# Altium schematic sheet Ultrascale_EG.SchDoc
size B; Organization: Altium Limited; Address1: L3, 12a Rodborough Rd; Address2: Frenchs Forest; Address3: NSW; Address4: Australia 2086
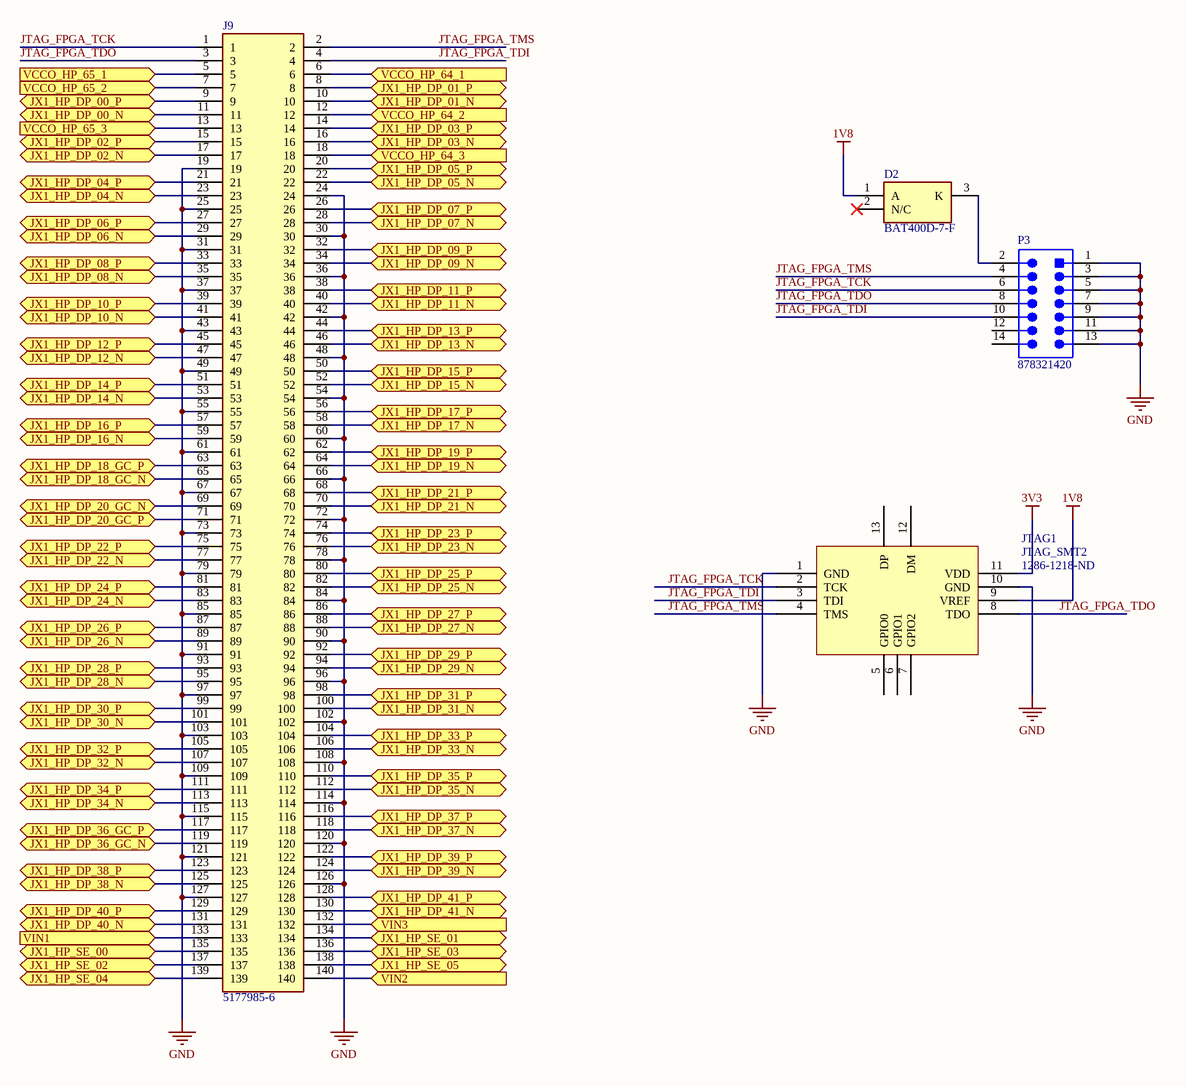
[diagram p0: Ultrascale_EG.SchDoc]

## Parts
D2  BAT400D-7-F  [SOT96P240X110-3N]
J9  5177985-6  [5177985-6]
JTAG1  JTAG_SMT2  Supplier Part Number 1: 1286-1218-ND  [JTAG_SMT2]
P3  878321420  [MOLX-878321420_V]

## Ports
JX1_HP_DP_00_N (bidir), JX1_HP_DP_00_P (bidir), JX1_HP_DP_01_N (bidir), JX1_HP_DP_01_P (bidir), JX1_HP_DP_02_N (bidir), JX1_HP_DP_02_P (bidir), JX1_HP_DP_03_N (bidir), JX1_HP_DP_03_P (bidir), JX1_HP_DP_04_N (bidir), JX1_HP_DP_04_P (bidir), JX1_HP_DP_05_N (bidir), JX1_HP_DP_05_P (bidir), JX1_HP_DP_06_N (bidir), JX1_HP_DP_06_P (bidir), JX1_HP_DP_07_N (bidir), JX1_HP_DP_07_P (bidir), JX1_HP_DP_08_N (bidir), JX1_HP_DP_08_P (bidir), JX1_HP_DP_09_N (bidir), JX1_HP_DP_09_P (bidir), JX1_HP_DP_10_N (bidir), JX1_HP_DP_10_P (bidir), JX1_HP_DP_11_N (bidir), JX1_HP_DP_11_P (bidir), JX1_HP_DP_12_N (bidir), JX1_HP_DP_12_P (bidir), JX1_HP_DP_13_N (bidir), JX1_HP_DP_13_P (bidir), JX1_HP_DP_14_N (bidir), JX1_HP_DP_14_P (bidir), JX1_HP_DP_15_N (bidir), JX1_HP_DP_15_P (bidir), JX1_HP_DP_16_N (bidir), JX1_HP_DP_16_P (bidir), JX1_HP_DP_17_N (bidir), JX1_HP_DP_17_P (bidir), JX1_HP_DP_18_GC_N (bidir), JX1_HP_DP_18_GC_P (bidir), JX1_HP_DP_19_N (bidir), JX1_HP_DP_19_P (bidir), JX1_HP_DP_20_GC_N (bidir), JX1_HP_DP_20_GC_P (bidir), JX1_HP_DP_21_N (bidir), JX1_HP_DP_21_P (bidir), JX1_HP_DP_22_N (bidir), JX1_HP_DP_22_P (bidir), JX1_HP_DP_23_N (bidir), JX1_HP_DP_23_P (bidir), JX1_HP_DP_24_N (bidir), JX1_HP_DP_24_P (bidir), JX1_HP_DP_25_N (bidir), JX1_HP_DP_25_P (bidir), JX1_HP_DP_26_N (bidir), JX1_HP_DP_26_P (bidir), JX1_HP_DP_27_N (bidir), JX1_HP_DP_27_P (bidir), JX1_HP_DP_28_N (bidir), JX1_HP_DP_28_P (bidir), JX1_HP_DP_29_N (bidir), JX1_HP_DP_29_P (bidir), JX1_HP_DP_30_N (bidir), JX1_HP_DP_30_P (bidir), JX1_HP_DP_31_N (bidir), JX1_HP_DP_31_P (bidir), JX1_HP_DP_32_N (bidir), JX1_HP_DP_32_P (bidir), JX1_HP_DP_33_N (bidir), JX1_HP_DP_33_P (bidir), JX1_HP_DP_34_N (bidir), JX1_HP_DP_34_P (bidir), JX1_HP_DP_35_N (bidir), JX1_HP_DP_35_P (bidir), JX1_HP_DP_36_GC_N (bidir), JX1_HP_DP_36_GC_P (bidir), JX1_HP_DP_37_N (bidir), JX1_HP_DP_37_P (bidir), JX1_HP_DP_38_N (bidir), JX1_HP_DP_38_P (bidir), JX1_HP_DP_39_N (bidir), JX1_HP_DP_39_P (bidir), JX1_HP_DP_40_N (bidir), JX1_HP_DP_40_P (bidir), JX1_HP_DP_41_N (bidir), JX1_HP_DP_41_P (bidir), JX1_HP_SE_00 (bidir), JX1_HP_SE_01 (bidir), JX1_HP_SE_02 (bidir), JX1_HP_SE_03 (bidir), JX1_HP_SE_04 (bidir), JX1_HP_SE_05 (bidir), VCCO_HP_64_1 (in), VCCO_HP_64_2 (in), VCCO_HP_64_3 (in), VCCO_HP_65_1 (in), VCCO_HP_65_2 (in), VCCO_HP_65_3 (in), VIN1 (in), VIN2 (in), VIN3 (in)

## Nets
1V8: D2.1(A) JTAG1.9(VREF)
3V3: JTAG1.11(VDD)
GND: J9.19 J9.24 J9.25 J9.30 J9.31 J9.36 J9.37 J9.42 J9.43 J9.48 J9.49 J9.54 J9.55 J9.60 J9.61 J9.66 J9.67 J9.72 J9.73 J9.78 J9.79 J9.84 J9.85 J9.90 J9.91 J9.96 J9.97 J9.102 J9.103 J9.108 J9.109 J9.114 J9.115 J9.120 J9.121 J9.126 J9.127 JTAG1.1(GND) JTAG1.10(GND) P3.1 P3.3 P3.5 P3.7 P3.9 P3.11 P3.13
JTAG_FPGA_TCK: J9.1 JTAG1.2(TCK) P3.6
JTAG_FPGA_TDI: J9.4 JTAG1.3(TDI) P3.10
JTAG_FPGA_TDO: J9.3 JTAG1.8(TDO) P3.8
JTAG_FPGA_TMS: J9.2 JTAG1.4(TMS) P3.4
JX1_HP_DP_00_N: J9.11 ; port JX1_HP_DP_00_N
JX1_HP_DP_00_P: J9.9 ; port JX1_HP_DP_00_P
JX1_HP_DP_01_N: J9.10 ; port JX1_HP_DP_01_N
JX1_HP_DP_01_P: J9.8 ; port JX1_HP_DP_01_P
JX1_HP_DP_02_N: J9.17 ; port JX1_HP_DP_02_N
JX1_HP_DP_02_P: J9.15 ; port JX1_HP_DP_02_P
JX1_HP_DP_03_N: J9.16 ; port JX1_HP_DP_03_N
JX1_HP_DP_03_P: J9.14 ; port JX1_HP_DP_03_P
JX1_HP_DP_04_N: J9.23 ; port JX1_HP_DP_04_N
JX1_HP_DP_04_P: J9.21 ; port JX1_HP_DP_04_P
JX1_HP_DP_05_N: J9.22 ; port JX1_HP_DP_05_N
JX1_HP_DP_05_P: J9.20 ; port JX1_HP_DP_05_P
JX1_HP_DP_06_N: J9.29 ; port JX1_HP_DP_06_N
JX1_HP_DP_06_P: J9.27 ; port JX1_HP_DP_06_P
JX1_HP_DP_07_N: J9.28 ; port JX1_HP_DP_07_N
JX1_HP_DP_07_P: J9.26 ; port JX1_HP_DP_07_P
JX1_HP_DP_08_N: J9.35 ; port JX1_HP_DP_08_N
JX1_HP_DP_08_P: J9.33 ; port JX1_HP_DP_08_P
JX1_HP_DP_09_N: J9.34 ; port JX1_HP_DP_09_N
JX1_HP_DP_09_P: J9.32 ; port JX1_HP_DP_09_P
JX1_HP_DP_10_N: J9.41 ; port JX1_HP_DP_10_N
JX1_HP_DP_10_P: J9.39 ; port JX1_HP_DP_10_P
JX1_HP_DP_11_N: J9.40 ; port JX1_HP_DP_11_N
JX1_HP_DP_11_P: J9.38 ; port JX1_HP_DP_11_P
JX1_HP_DP_12_N: J9.47 ; port JX1_HP_DP_12_N
JX1_HP_DP_12_P: J9.45 ; port JX1_HP_DP_12_P
JX1_HP_DP_13_N: J9.46 ; port JX1_HP_DP_13_N
JX1_HP_DP_13_P: J9.44 ; port JX1_HP_DP_13_P
JX1_HP_DP_14_N: J9.53 ; port JX1_HP_DP_14_N
JX1_HP_DP_14_P: J9.51 ; port JX1_HP_DP_14_P
JX1_HP_DP_15_N: J9.52 ; port JX1_HP_DP_15_N
JX1_HP_DP_15_P: J9.50 ; port JX1_HP_DP_15_P
JX1_HP_DP_16_N: J9.59 ; port JX1_HP_DP_16_N
JX1_HP_DP_16_P: J9.57 ; port JX1_HP_DP_16_P
JX1_HP_DP_17_N: J9.58 ; port JX1_HP_DP_17_N
JX1_HP_DP_17_P: J9.56 ; port JX1_HP_DP_17_P
JX1_HP_DP_18_GC_N: J9.65 ; port JX1_HP_DP_18_GC_N
JX1_HP_DP_18_GC_P: J9.63 ; port JX1_HP_DP_18_GC_P
JX1_HP_DP_19_N: J9.64 ; port JX1_HP_DP_19_N
JX1_HP_DP_19_P: J9.62 ; port JX1_HP_DP_19_P
JX1_HP_DP_20_GC_N: J9.69 ; port JX1_HP_DP_20_GC_N
JX1_HP_DP_20_GC_P: J9.71 ; port JX1_HP_DP_20_GC_P
JX1_HP_DP_21_N: J9.70 ; port JX1_HP_DP_21_N
JX1_HP_DP_21_P: J9.68 ; port JX1_HP_DP_21_P
JX1_HP_DP_22_N: J9.77 ; port JX1_HP_DP_22_N
JX1_HP_DP_22_P: J9.75 ; port JX1_HP_DP_22_P
JX1_HP_DP_23_N: J9.76 ; port JX1_HP_DP_23_N
JX1_HP_DP_23_P: J9.74 ; port JX1_HP_DP_23_P
JX1_HP_DP_24_N: J9.83 ; port JX1_HP_DP_24_N
JX1_HP_DP_24_P: J9.81 ; port JX1_HP_DP_24_P
JX1_HP_DP_25_N: J9.82 ; port JX1_HP_DP_25_N
JX1_HP_DP_25_P: J9.80 ; port JX1_HP_DP_25_P
JX1_HP_DP_26_N: J9.89 ; port JX1_HP_DP_26_N
JX1_HP_DP_26_P: J9.87 ; port JX1_HP_DP_26_P
JX1_HP_DP_27_N: J9.88 ; port JX1_HP_DP_27_N
JX1_HP_DP_27_P: J9.86 ; port JX1_HP_DP_27_P
JX1_HP_DP_28_N: J9.95 ; port JX1_HP_DP_28_N
JX1_HP_DP_28_P: J9.93 ; port JX1_HP_DP_28_P
JX1_HP_DP_29_N: J9.94 ; port JX1_HP_DP_29_N
JX1_HP_DP_29_P: J9.92 ; port JX1_HP_DP_29_P
JX1_HP_DP_30_N: J9.101 ; port JX1_HP_DP_30_N
JX1_HP_DP_30_P: J9.99 ; port JX1_HP_DP_30_P
JX1_HP_DP_31_N: J9.100 ; port JX1_HP_DP_31_N
JX1_HP_DP_31_P: J9.98 ; port JX1_HP_DP_31_P
JX1_HP_DP_32_N: J9.107 ; port JX1_HP_DP_32_N
JX1_HP_DP_32_P: J9.105 ; port JX1_HP_DP_32_P
JX1_HP_DP_33_N: J9.106 ; port JX1_HP_DP_33_N
JX1_HP_DP_33_P: J9.104 ; port JX1_HP_DP_33_P
JX1_HP_DP_34_N: J9.113 ; port JX1_HP_DP_34_N
JX1_HP_DP_34_P: J9.111 ; port JX1_HP_DP_34_P
JX1_HP_DP_35_N: J9.112 ; port JX1_HP_DP_35_N
JX1_HP_DP_35_P: J9.110 ; port JX1_HP_DP_35_P
JX1_HP_DP_36_GC_N: J9.119 ; port JX1_HP_DP_36_GC_N
JX1_HP_DP_36_GC_P: J9.117 ; port JX1_HP_DP_36_GC_P
JX1_HP_DP_37_N: J9.118 ; port JX1_HP_DP_37_N
JX1_HP_DP_37_P: J9.116 ; port JX1_HP_DP_37_P
JX1_HP_DP_38_N: J9.125 ; port JX1_HP_DP_38_N
JX1_HP_DP_38_P: J9.123 ; port JX1_HP_DP_38_P
JX1_HP_DP_39_N: J9.124 ; port JX1_HP_DP_39_N
JX1_HP_DP_39_P: J9.122 ; port JX1_HP_DP_39_P
JX1_HP_DP_40_N: J9.131 ; port JX1_HP_DP_40_N
JX1_HP_DP_40_P: J9.129 ; port JX1_HP_DP_40_P
JX1_HP_DP_41_N: J9.130 ; port JX1_HP_DP_41_N
JX1_HP_DP_41_P: J9.128 ; port JX1_HP_DP_41_P
JX1_HP_SE_00: J9.135 ; port JX1_HP_SE_00
JX1_HP_SE_01: J9.134 ; port JX1_HP_SE_01
JX1_HP_SE_02: J9.137 ; port JX1_HP_SE_02
JX1_HP_SE_03: J9.136 ; port JX1_HP_SE_03
JX1_HP_SE_04: J9.139 ; port JX1_HP_SE_04
JX1_HP_SE_05: J9.138 ; port JX1_HP_SE_05
VCCO_HP_64_1: J9.6 ; port VCCO_HP_64_1
VCCO_HP_64_2: J9.12 ; port VCCO_HP_64_2
VCCO_HP_64_3: J9.18 ; port VCCO_HP_64_3
VCCO_HP_65_1: J9.5 ; port VCCO_HP_65_1
VCCO_HP_65_2: J9.7 ; port VCCO_HP_65_2
VCCO_HP_65_3: J9.13 ; port VCCO_HP_65_3
VIN1: J9.133 ; port VIN1
VIN2: J9.140 ; port VIN2
VIN3: J9.132 ; port VIN3
NetD2_3: D2.3(K) P3.2

Not connected (* = marked no-connect by the designer): D2 2(N/C)*; JTAG1 5(GPIO0) 6(GPIO1) 7(GPIO2) 12(DM) 13(DP); P3 12 14

## Notes on the sheet
- Title
- Size:
- Date:
- B
- Number:
- Time:
- Revision:
- Sheet
- of
- File:

## Library data of the parts
D2 = BAT400D-7-F: Schottky Diode; Manufacturer_Name: Diodes Inc.; Datasheet Link: https://www.diodes.com/assets/Datasheets/ds30182.pdf; Height: 1.1mm; Manufacturer_Part_Number: BAT400D-7-F; Mouser Part Number: 621-BAT400D-F; Mouser Price/Stock: https://www.mouser.com/Search/Refine.aspx?Keyword=621-BAT400D-F; RS Part Number: 7513354P; RS Price/Stock: http://uk.rs-online.com/web/p/products/7513354P
J9 = 5177985-6: Connector; Manufacturer_Name: TE Connectivity; Datasheet Link: https://www.te.com/commerce/DocumentDelivery/DDEController?Action=srchrtrv&DocNm=5177985&DocType=Customer+Drawing&DocLang=English&DocFormat=pdf&PartCntxt=5177985-6; Manufacturer_Part_Number: 5177985-6; Mouser Part Number: 571-5177985-6; Mouser Price/Stock: https://www.mouser.com/Search/Refine.aspx?Keyword=571-5177985-6
P3 = CMP-2000-05520-1: Male Header, Pitch 2 mm, 2 x 7 Position, Height 7.6 mm, -55 to 105 degC, RoHS; Manufacturer: Molex; Datasheet URL: http://www.molex.com/pdm_docs/sd/878321420_sd.pdf; Package Description: Male Header, Pitch 2 mm, 2 x 7 Positions, Height 7.6 mm; Manufacturer URL: http://www.molex.com/; Package Reference: 878321420; Datasheet Version: Rev. G, 01/2012; Mounting Technology: SurfaceMount
JTAG1 = JTAG_SMT2: Supplier 1: Digi-Key